# Altium schematic sheet No_Connects.SchDoc
size Letter; SheetNumber: 2; SheetTotal: 3
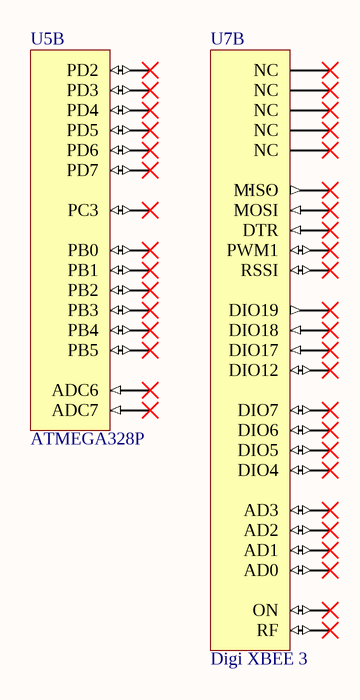
[diagram p0: No_Connects.SchDoc]

## Parts
U5  Part Number: ATMEGA328P  [32A_ATM]  (hidden comment: ATMEGA328P_SMD)  (part B of 4)
U7  Part Number: Digi XBEE 3  [XBee_1W_Base]  (hidden comment: XBEE 3 SMD)  (part B of 3)

## Nets

Not connected (* = marked no-connect by the designer): U5 1(PD3)* 2(PD4)* 9(PD5)* 10(PD6)* 11(PD7)* 12(PB0)* 13(PB1)* 14(PB2)* 15(PB3)* 16(PB4)* 17(PB5)* 19(ADC6)* 22(ADC7)* 26(PC3)* 32(PD2)*; U7 5(DIO12)* 7(RSSI)* 8(PWM1)* 10(DTR)* 12(DIO19)* 14(DIO18)* 15(DIO17)* 16(MOSI)* 17(MISO)* 18(NC) 19(NC) 21(NC)* 23(NC)* 24(DIO4)* 25(DIO7)* 26(ON)* 27(NC)* 28(DIO5)* 29(DIO6)* 30(AD3)* 31(AD2)* 32(AD1)* 33(AD0)* 34(NC)* 36(RF)* 37(NC)*

## Library data of the parts
U5 = ATMEGA328P_SMD: Arduino ATMEGA328 Chip; Supplier 1: Digi-Key; Supplier Part Number 1: ATMEGA328P-AURCT-ND
U7 = XBEE 3 SMD: Supplier 1: Digi-Key; Supplier Part Number 1: 602-2200-ND